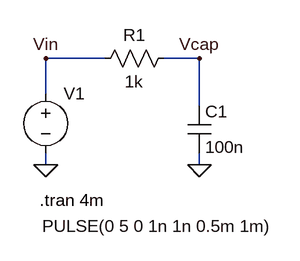
[diagram p0: schematic rcCircuit.asc]
rcCircuit.asc, the LTspice schematic file:
Version 4.1
SHEET 1 880 680
WIRE 208 48 128 48
WIRE 336 48 288 48
WIRE 128 96 128 48
WIRE 336 112 336 48
WIRE 128 192 128 176
WIRE 336 192 336 176
FLAG 128 192 0
FLAG 336 192 0
FLAG 336 48 Vcap
FLAG 128 48 Vin
SYMBOL voltage 128 80 R0
WINDOW 3 -5 195 Left 2
WINDOW 123 0 0 Left 0
WINDOW 39 0 0 Left 0
SYMATTR Value PULSE(0 5 0 1n 1n 0.5m 1m)
SYMATTR InstName V1
SYMBOL res 304 32 R90
WINDOW 0 0 56 VBottom 2
WINDOW 3 32 56 VTop 2
SYMATTR InstName R1
SYMATTR Value 1k
SYMBOL cap 320 112 R0
SYMATTR InstName C1
SYMATTR Value 100n
TEXT 120 240 Left 2 !.tran 4m

The netlist it stands for:
* rcCircuit.asc
V1 Vin 0 PULSE(0 5 0 1n 1n 0.5m 1m)
R1 Vcap Vin 1k
C1 Vcap 0 100n
.tran 4m
.backanno
.end

* Results of the author's LTspice run, read from the files saved beside the schematic
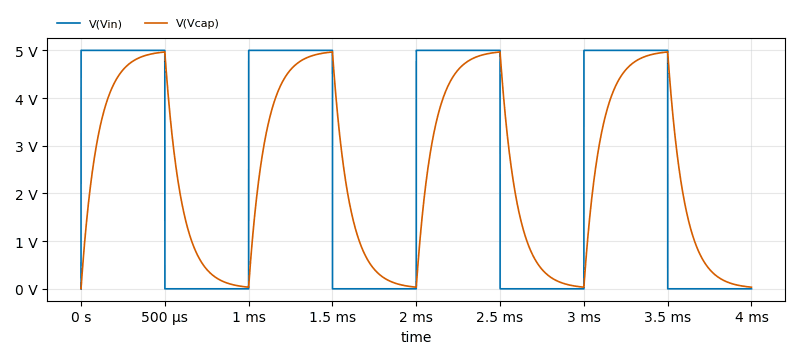
[diagram p1: Transient Analysis of rcCircuit.asc, plotted from the saved traces]
* Transient Analysis, 1 run:
*   V(Vin): min 0 V, max 5 V, average 2.5 V, rms 3.536 V, last 0 V
*   V(Vcap): min 0 V, max 4.967 V, average 2.499 V, rms 3.167 V, last 33.44 mV